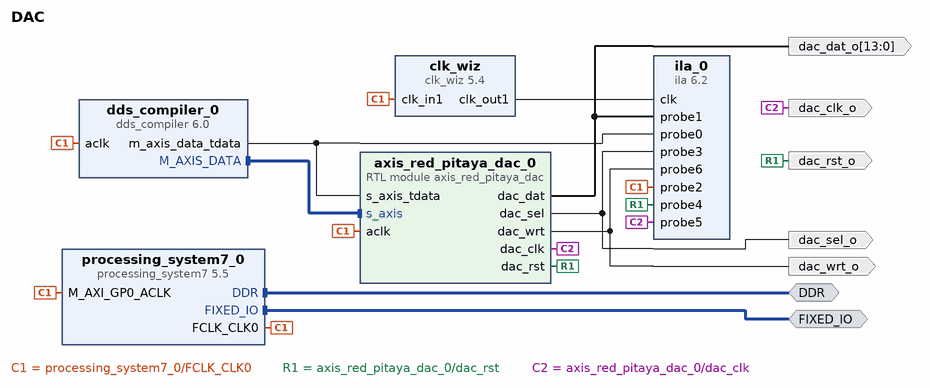
[diagram p0: block diagram of the top level]
# Vivado block design DAC, xc7z010clg400-1, Vivado 2017.4
create_bd_design DAC

create_bd_intf_port -mode Master -vlnv xilinx.com:interface:ddrx_rtl:1.0 DDR
create_bd_intf_port -mode Master -vlnv xilinx.com:display_processing_system7:fixedio_rtl:1.0 FIXED_IO
create_bd_port -dir O -type clk dac_clk_o
create_bd_port -dir O -type rst dac_rst_o
create_bd_port -dir O dac_sel_o
create_bd_port -dir O dac_wrt_o
create_bd_port -dir O -from 13 -to 0 dac_dat_o

create_bd_cell -type ip -vlnv xilinx.com:ip:processing_system7:5.5 processing_system7_0
set_property -dict [list \
  CONFIG.PCW_UART_PERIPHERAL_FREQMHZ 100 \
  CONFIG.PCW_FPGA0_PERIPHERAL_FREQMHZ 125 \
  CONFIG.PCW_UIPARAM_DDR_BUS_WIDTH {16 Bit} \
  CONFIG.PCW_UIPARAM_DDR_PARTNO {MT41J256M16 RE-125} \
  CONFIG.PCW_QSPI_PERIPHERAL_ENABLE 1 \
  CONFIG.PCW_QSPI_QSPI_IO {MIO 1 .. 6} \
  CONFIG.PCW_QSPI_GRP_SINGLE_SS_ENABLE 1 \
  CONFIG.PCW_QSPI_GRP_SINGLE_SS_IO {MIO 1 .. 6} \
  CONFIG.PCW_SINGLE_QSPI_DATA_MODE x4 \
  CONFIG.PCW_UART0_PERIPHERAL_ENABLE 1 \
  CONFIG.PCW_UART0_UART0_IO {MIO 14 .. 15} \
] [get_bd_cells processing_system7_0]
# 61 more settings of processing_system7_0 are not shown: defaults, MIO pin electricals, DDR timing, and values the tool derives
create_bd_cell -type ip -vlnv xilinx.com:ip:dds_compiler:6.0 dds_compiler_0
set_property -dict [list \
  CONFIG.PartsPresent Phase_Generator_and_SIN_COS_LUT \
  CONFIG.DDS_Clock_Rate 125 \
  CONFIG.Parameter_Entry Hardware_Parameters \
  CONFIG.Frequency_Resolution 0.4 \
  CONFIG.Noise_Shaping None \
  CONFIG.Phase_Width 16 \
  CONFIG.Output_Width 14 \
  CONFIG.Output_Selection Sine \
  CONFIG.Has_Phase_Out false \
  CONFIG.DATA_Has_TLAST Not_Required \
  CONFIG.S_PHASE_Has_TUSER Not_Required \
  CONFIG.M_DATA_Has_TUSER Not_Required \
  CONFIG.Latency 7 \
  CONFIG.Output_Frequency1 0 \
  CONFIG.PINC1 1000001100 \
] [get_bd_cells dds_compiler_0]
create_bd_cell -type ip -vlnv xilinx.com:ip:ila:6.2 ila_0
set_property -dict [list \
  CONFIG.C_PROBE1_WIDTH 14 \
  CONFIG.C_PROBE0_WIDTH 16 \
  CONFIG.C_DATA_DEPTH 4096 \
  CONFIG.C_NUM_OF_PROBES 7 \
  CONFIG.C_ENABLE_ILA_AXI_MON false \
  CONFIG.C_MONITOR_TYPE Native \
] [get_bd_cells ila_0]
create_bd_cell -type ip -vlnv xilinx.com:ip:clk_wiz:5.4 clk_wiz
set_property -dict [list \
  CONFIG.PRIM_IN_FREQ 125.000 \
  CONFIG.CLKIN1_JITTER_PS 80.0 \
  CONFIG.CLKOUT1_REQUESTED_OUT_FREQ 275.000 \
  CONFIG.MMCM_DIVCLK_DIVIDE 5 \
  CONFIG.MMCM_CLKFBOUT_MULT_F 39.875 \
  CONFIG.MMCM_CLKIN1_PERIOD 8.000 \
  CONFIG.MMCM_CLKOUT0_DIVIDE_F 3.625 \
  CONFIG.CLKOUT1_JITTER 182.448 \
  CONFIG.CLKOUT1_PHASE_ERROR 233.925 \
] [get_bd_cells clk_wiz]
create_bd_cell -type module -reference axis_red_pitaya_dac axis_red_pitaya_dac_0

# ---- connections ----

connect_bd_intf_net [get_bd_intf_pins dds_compiler_0/M_AXIS_DATA] [get_bd_intf_pins axis_red_pitaya_dac_0/s_axis]
connect_bd_intf_net [get_bd_intf_ports DDR] [get_bd_intf_pins processing_system7_0/DDR]
connect_bd_intf_net [get_bd_intf_ports FIXED_IO] [get_bd_intf_pins processing_system7_0/FIXED_IO]
connect_bd_net [get_bd_pins processing_system7_0/FCLK_CLK0] \
  [get_bd_pins processing_system7_0/M_AXI_GP0_ACLK] [get_bd_pins dds_compiler_0/aclk] [get_bd_pins ila_0/probe2] \
  [get_bd_pins clk_wiz/clk_in1] [get_bd_pins axis_red_pitaya_dac_0/aclk]
connect_bd_net [get_bd_pins dds_compiler_0/m_axis_data_tdata] [get_bd_pins ila_0/probe0] [get_bd_pins axis_red_pitaya_dac_0/s_axis_tdata]
connect_bd_net [get_bd_pins axis_red_pitaya_dac_0/dac_rst] [get_bd_ports dac_rst_o] [get_bd_pins ila_0/probe4]
connect_bd_net [get_bd_pins axis_red_pitaya_dac_0/dac_sel] [get_bd_ports dac_sel_o] [get_bd_pins ila_0/probe3]
connect_bd_net [get_bd_pins axis_red_pitaya_dac_0/dac_dat] [get_bd_ports dac_dat_o] [get_bd_pins ila_0/probe1]
connect_bd_net [get_bd_pins clk_wiz/clk_out1] [get_bd_pins ila_0/clk]
connect_bd_net [get_bd_pins axis_red_pitaya_dac_0/dac_wrt] [get_bd_ports dac_wrt_o] [get_bd_pins ila_0/probe6]
connect_bd_net [get_bd_pins axis_red_pitaya_dac_0/dac_clk] [get_bd_ports dac_clk_o] [get_bd_pins ila_0/probe5]

validate_bd_design
save_bd_design
